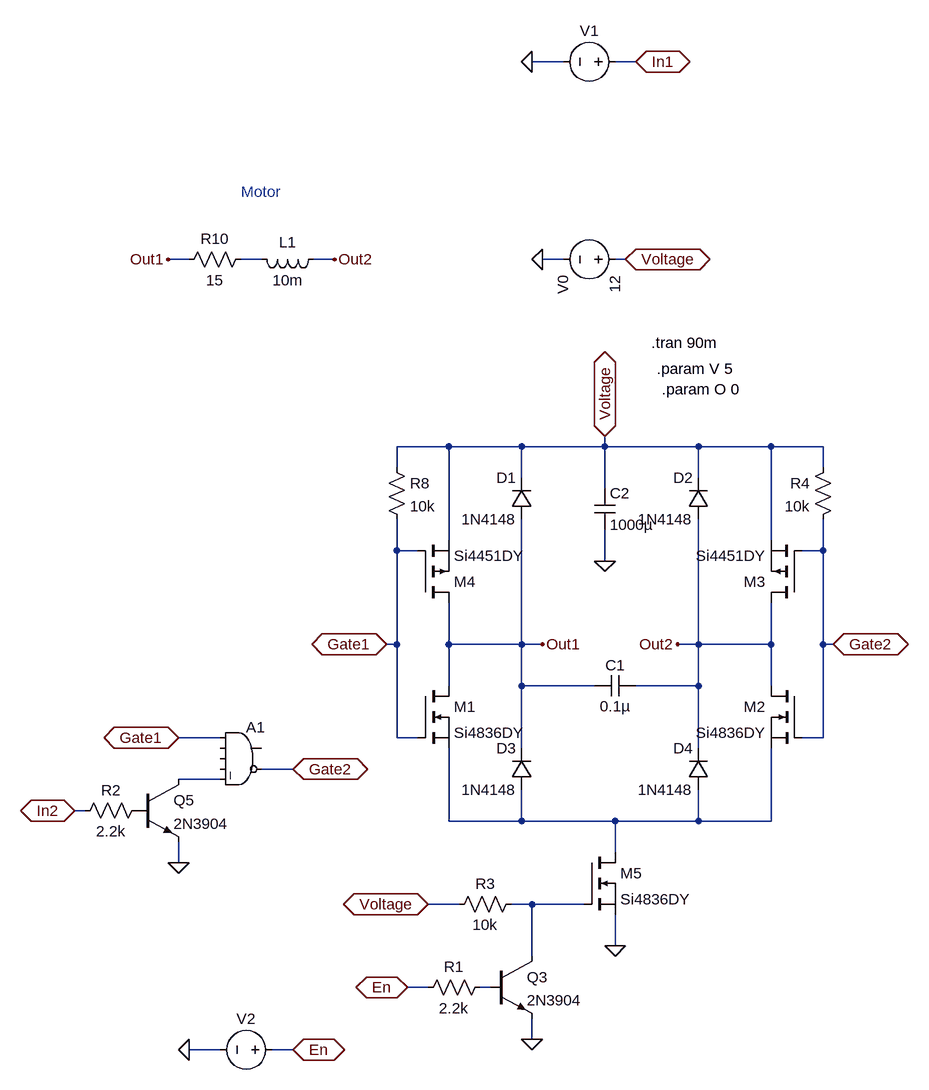
[diagram p0: schematic HBridge.asc]
HBridge.asc, the LTspice schematic file:
Version 4
SHEET 1 2808 1048
WIRE 288 -832 240 -832
WIRE 400 -832 368 -832
WIRE -288 -528 -320 -528
WIRE -176 -528 -208 -528
WIRE -64 -528 -96 -528
WIRE 288 -528 256 -528
WIRE 384 -528 368 -528
WIRE 112 -240 32 -240
WIRE 224 -240 112 -240
WIRE 352 -240 352 -256
WIRE 352 -240 224 -240
WIRE 496 -240 352 -240
WIRE 608 -240 496 -240
WIRE 688 -240 608 -240
WIRE 32 -208 32 -240
WIRE 688 -208 688 -240
WIRE 224 -192 224 -240
WIRE 496 -192 496 -240
WIRE 352 -176 352 -240
WIRE 112 -96 112 -240
WIRE 608 -96 608 -240
WIRE 32 -80 32 -128
WIRE 64 -80 32 -80
WIRE 688 -80 688 -128
WIRE 688 -80 656 -80
WIRE 352 -64 352 -112
WIRE 32 64 32 -80
WIRE 32 64 16 64
WIRE 112 64 112 0
WIRE 224 64 224 -128
WIRE 224 64 112 64
WIRE 256 64 224 64
WIRE 496 64 496 -128
WIRE 496 64 464 64
WIRE 608 64 608 0
WIRE 608 64 496 64
WIRE 688 64 688 -80
WIRE 704 64 688 64
WIRE 112 128 112 64
WIRE 224 128 224 64
WIRE 336 128 224 128
WIRE 496 128 496 64
WIRE 496 128 400 128
WIRE 608 128 608 64
WIRE -240 208 -304 208
WIRE 32 208 32 64
WIRE 64 208 32 208
WIRE 688 208 688 64
WIRE 688 208 656 208
WIRE 224 224 224 128
WIRE 496 224 496 128
WIRE -128 256 -176 256
WIRE -240 272 -304 272
WIRE -448 320 -464 320
WIRE 112 336 112 224
WIRE 224 336 224 288
WIRE 224 336 112 336
WIRE 368 336 224 336
WIRE 496 336 496 288
WIRE 496 336 368 336
WIRE 608 336 608 224
WIRE 608 336 496 336
WIRE 368 384 368 336
WIRE -304 400 -304 368
WIRE 128 464 80 464
WIRE 240 464 208 464
WIRE 320 464 240 464
WIRE 368 528 368 480
WIRE 240 544 240 464
WIRE 80 592 48 592
WIRE 176 592 160 592
WIRE 240 672 240 640
WIRE -240 688 -288 688
WIRE -128 688 -160 688
FLAG 48 592 En
IOPIN 48 592 BiDir
FLAG 256 64 Out1
FLAG 464 64 Out2
FLAG 368 528 0
FLAG 256 -528 0
FLAG 400 -832 In1
IOPIN 400 -832 BiDir
FLAG 240 -832 0
FLAG -128 688 En
IOPIN -128 688 BiDir
FLAG -288 688 0
FLAG 352 -256 Voltage
IOPIN 352 -256 BiDir
FLAG 384 -528 Voltage
IOPIN 384 -528 BiDir
FLAG -464 320 In2
IOPIN -464 320 BiDir
FLAG 16 64 Gate1
IOPIN 16 64 BiDir
FLAG 704 64 Gate2
IOPIN 704 64 BiDir
FLAG -320 -528 Out1
FLAG -64 -528 Out2
FLAG 352 -64 0
FLAG 240 672 0
FLAG 80 464 Voltage
IOPIN 80 464 BiDir
FLAG -304 400 0
FLAG -304 208 Gate1
IOPIN -304 208 BiDir
FLAG -128 256 Gate2
IOPIN -128 256 BiDir
SYMBOL diode 240 -128 R180
WINDOW 0 24 64 Left 2
WINDOW 3 24 0 Left 2
SYMATTR InstName D1
SYMATTR Value 1N4148
SYMBOL diode 512 -128 R180
WINDOW 0 24 64 Left 2
WINDOW 3 24 0 Left 2
SYMATTR InstName D2
SYMATTR Value 1N4148
SYMBOL diode 240 288 R180
WINDOW 0 24 64 Left 2
WINDOW 3 24 0 Left 2
SYMATTR InstName D3
SYMATTR Value 1N4148
SYMBOL diode 512 288 R180
WINDOW 0 24 64 Left 2
WINDOW 3 24 0 Left 2
SYMATTR InstName D4
SYMATTR Value 1N4148
SYMBOL res 176 576 R90
WINDOW 0 0 56 VBottom 2
WINDOW 3 32 56 VTop 2
SYMATTR InstName R1
SYMATTR Value 2.2k
SYMBOL voltage 384 -528 R90
WINDOW 0 24 96 Left 2
WINDOW 3 24 16 Left 2
WINDOW 123 0 0 Left 0
WINDOW 39 0 0 Left 0
SYMATTR InstName V0
SYMATTR Value 12
SYMBOL voltage 384 -832 R90
WINDOW 0 -32 56 VBottom 2
WINDOW 3 32 56 Invisible 2
WINDOW 123 0 0 Left 0
WINDOW 39 0 0 Left 0
SYMATTR InstName V1
SYMATTR Value PWL(0 {O} 10m {O} 11m {V} 17m {V} 18m {O} 39m {O} 40m {O} 60m {O})
SYMBOL voltage -144 688 R90
WINDOW 0 -32 56 VBottom 2
WINDOW 3 32 56 Invisible 2
WINDOW 123 0 0 Left 0
WINDOW 39 0 0 Left 0
SYMATTR InstName V2
SYMATTR Value PWL(0 {O} 10m {O} 11m {O} 19m {O} 20m {O} 24m {O} 25m {V} 35m {V} 36m {O} 60m {O})
SYMBOL ind -80 -544 R90
WINDOW 0 5 56 VBottom 2
WINDOW 3 32 56 VTop 2
SYMATTR InstName L1
SYMATTR Value 10m
SYMBOL res 16 -224 R0
SYMATTR InstName R8
SYMATTR Value 10k
SYMBOL res -192 -544 R90
WINDOW 0 0 56 VBottom 2
WINDOW 3 32 56 VTop 2
SYMATTR InstName R10
SYMATTR Value 15
SYMBOL npn 176 544 R0
SYMATTR InstName Q3
SYMATTR Value 2N3904
SYMBOL res -352 304 R90
WINDOW 0 0 56 VBottom 2
WINDOW 3 32 56 VTop 2
SYMATTR InstName R2
SYMATTR Value 2.2k
SYMBOL res 704 -224 M0
SYMATTR InstName R4
SYMATTR Value 10k
SYMBOL npn -368 272 R0
SYMATTR InstName Q5
SYMATTR Value 2N3904
SYMBOL nmos 64 128 R0
SYMATTR InstName M1
SYMATTR Value Si4836DY
SYMBOL nmos 656 128 M0
SYMATTR InstName M2
SYMATTR Value Si4836DY
SYMBOL pmos 656 0 R180
SYMATTR InstName M3
SYMATTR Value Si4451DY
SYMBOL pmos 64 0 M180
SYMATTR InstName M4
SYMATTR Value Si4451DY
SYMBOL Digital\\and -208 176 R0
SYMATTR InstName A1
SYMBOL nmos 320 384 R0
SYMATTR InstName M5
SYMATTR Value Si4836DY
SYMBOL cap 400 112 R90
WINDOW 0 0 32 VBottom 2
WINDOW 3 32 32 VTop 2
SYMATTR InstName C1
SYMATTR Value 0.1µ
SYMBOL cap 336 -176 R0
SYMATTR InstName C2
SYMATTR Value 1000µ
SYMBOL res 224 448 R90
WINDOW 0 0 56 VBottom 2
WINDOW 3 32 56 VTop 2
SYMATTR InstName R3
SYMATTR Value 10k
TEXT 424 -400 Left 2 !.tran 90m
TEXT 432 -360 Left 2 !.param V 5
TEXT 440 -328 Left 2 !.param O 0
TEXT -208 -632 Left 2 ;Motor

The netlist it stands for:
* HBridge.asc
D1 Out1 Voltage 1N4148
D2 Out2 Voltage 1N4148
D3 N003 Out1 1N4148
D4 N003 Out2 1N4148
R1 N005 En 2.2k
V0 Voltage 0 12
V1 In1 0 PWL(0 {O} 10m {O} 11m {V} 17m {V} 18m {O} 39m {O} 40m {O} 60m {O})
V2 En 0 PWL(0 {O} 10m {O} 11m {O} 19m {O} 20m {O} 24m {O} 25m {V} 35m {V} 36m {O} 60m {O})
L1 Out2 N001 10m
R8 Voltage Gate1 10k
R10 N001 Out1 15
Q3 N004 N005 0 0 2N3904
R2 P001 In2 2.2k
R4 Voltage Gate2 10k
Q5 N002 P001 0 0 2N3904
M1 Out1 Gate1 N003 N003 Si4836DY
M2 Out2 Gate2 N003 N003 Si4836DY
M3 Out2 Gate2 Voltage Voltage Si4451DY
M4 Out1 Gate1 Voltage Voltage Si4451DY
A1 Gate1 0 0 0 N002 Gate2 0 0 AND
M5 N003 N004 0 0 Si4836DY
C1 Out2 Out1 0.1µ
C2 Voltage 0 1000µ
R3 N004 Voltage 10k
.model D D
.lib standard.dio
.model NPN NPN
.model PNP PNP
.lib standard.bjt
.model NMOS NMOS
.model PMOS PMOS
.lib standard.mos
.tran 90m
.param V 5
.param O 0
* Motor
.backanno
.end